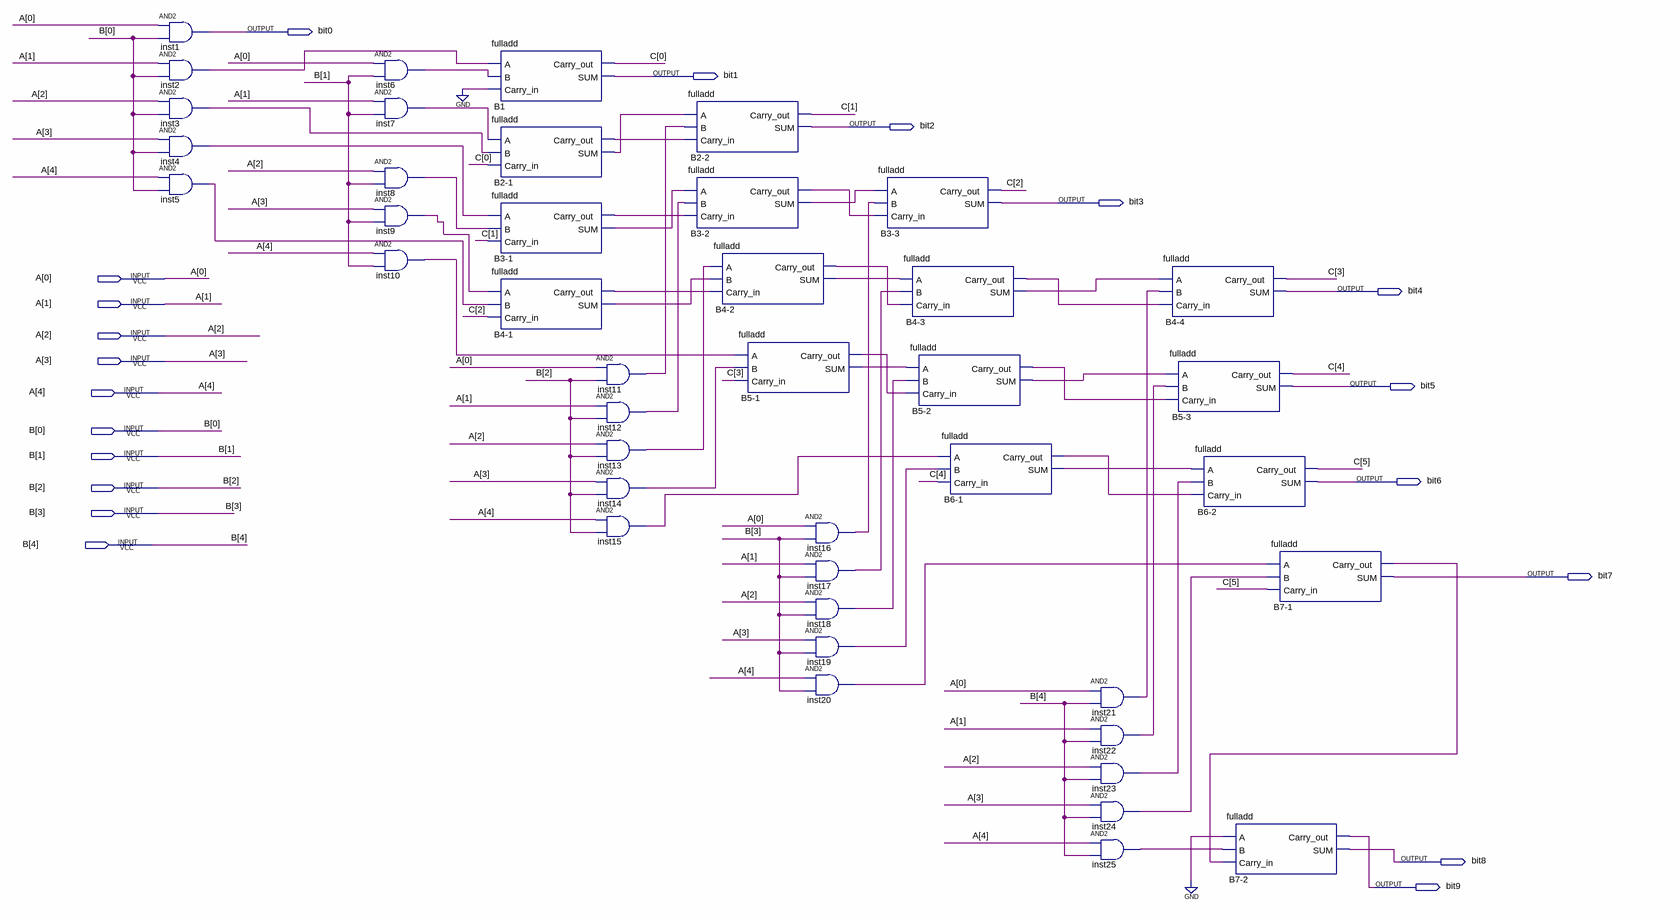
[diagram p0: schematic sheet]
// Quartus schematic multcomb2.bdf as structural Verilog: 42 symbols, 20 pins
module multcomb2 (
  input  [4:0] A,
  input  [4:0] B,
  output bit0,
  output bit1,
  output bit2,
  output bit3,
  output bit4,
  output bit5,
  output bit6,
  output bit7,
  output bit8,
  output bit9
);

  wire B2_1_carry_out, B2_1_sum, B3_1_carry_out, B3_1_sum, B3_2_carry_out, B3_2_sum, B4_1_carry_out,
       B4_1_sum, B4_2_carry_out, B4_2_sum, B4_3_carry_out, B4_3_sum, B5_1_carry_out, B5_1_sum,
       B5_2_carry_out, B5_2_sum, B6_1_carry_out, B6_1_sum, B7_1_carry_out, inst2_out, inst3_out, inst4_out,
       inst5_out, inst6_out, inst7_out, inst8_out, inst9_out, inst10_out, inst11_out, inst12_out, inst13_out,
       inst14_out, inst15_out, inst16_out, inst17_out, inst18_out, inst19_out, inst20_out, inst21_out,
       inst22_out, inst23_out, inst24_out, inst25_out;
  wire [5:0] C;

  and inst1 (bit0, A[0], B[0]);
  and inst2 (inst2_out, A[1], B[0]);
  and inst3 (inst3_out, A[2], B[0]);
  and inst4 (inst4_out, A[3], B[0]);
  and inst5 (inst5_out, A[4], B[0]);
  and inst6 (inst6_out, A[0], B[1]);
  and inst7 (inst7_out, A[1], B[1]);
  and inst8 (inst8_out, A[2], B[1]);
  and inst9 (inst9_out, A[3], B[1]);
  and inst10 (inst10_out, A[4], B[1]);
  fulladd B1 (.A(inst2_out), .B(inst6_out), .Carry_in(1'b0), .Carry_out(C[0]), .SUM(bit1));
  fulladd \B2-1  (.A(inst7_out), .B(inst3_out), .Carry_in(C[0]), .Carry_out(B2_1_carry_out), .SUM(B2_1_sum));
  fulladd \B3-1  (.A(inst4_out), .B(inst8_out), .Carry_in(C[1]), .Carry_out(B3_1_carry_out), .SUM(B3_1_sum));
  fulladd \B4-1  (.A(inst9_out), .B(inst5_out), .Carry_in(C[2]), .Carry_out(B4_1_carry_out), .SUM(B4_1_sum));
  and inst11 (inst11_out, A[0], B[2]);
  and inst12 (inst12_out, A[1], B[2]);
  and inst13 (inst13_out, A[2], B[2]);
  and inst14 (inst14_out, A[3], B[2]);
  and inst15 (inst15_out, A[4], B[2]);
  fulladd \B2-2  (.A(B2_1_sum), .B(inst11_out), .Carry_in(B2_1_carry_out), .Carry_out(C[1]), .SUM(bit2));
  fulladd \B3-2  (.A(B3_1_sum), .B(inst12_out), .Carry_in(B3_1_carry_out), .Carry_out(B3_2_carry_out), .SUM(B3_2_sum));
  fulladd \B4-2  (.A(inst13_out), .B(B4_1_sum), .Carry_in(B4_1_carry_out), .Carry_out(B4_2_carry_out), .SUM(B4_2_sum));
  fulladd \B5-1  (.A(inst10_out), .B(inst14_out), .Carry_in(C[3]), .Carry_out(B5_1_carry_out), .SUM(B5_1_sum));
  and inst16 (inst16_out, A[0], B[3]);
  and inst17 (inst17_out, A[1], B[3]);
  and inst18 (inst18_out, A[2], B[3]);
  and inst19 (inst19_out, A[3], B[3]);
  and inst20 (inst20_out, A[4], B[3]);
  fulladd \B3-3  (.A(B3_2_sum), .B(inst16_out), .Carry_in(B3_2_carry_out), .Carry_out(C[2]), .SUM(bit3));
  fulladd \B4-3  (.A(B4_2_sum), .B(inst17_out), .Carry_in(B4_2_carry_out), .Carry_out(B4_3_carry_out), .SUM(B4_3_sum));
  fulladd \B5-2  (.A(B5_1_sum), .B(inst18_out), .Carry_in(B5_1_carry_out), .Carry_out(B5_2_carry_out), .SUM(B5_2_sum));
  fulladd \B6-1  (.A(inst15_out), .B(inst19_out), .Carry_in(C[4]), .Carry_out(B6_1_carry_out), .SUM(B6_1_sum));
  and inst21 (inst21_out, A[0], B[4]);
  and inst22 (inst22_out, A[1], B[4]);
  and inst23 (inst23_out, A[2], B[4]);
  and inst24 (inst24_out, A[3], B[4]);
  and inst25 (inst25_out, A[4], B[4]);
  fulladd \B4-4  (.A(B4_3_sum), .B(inst21_out), .Carry_in(B4_3_carry_out), .Carry_out(C[3]), .SUM(bit4));
  fulladd \B5-3  (.A(B5_2_sum), .B(inst22_out), .Carry_in(B5_2_carry_out), .Carry_out(C[4]), .SUM(bit5));
  fulladd \B6-2  (.A(B6_1_sum), .B(inst23_out), .Carry_in(B6_1_carry_out), .Carry_out(C[5]), .SUM(bit6));
  fulladd \B7-1  (.A(inst20_out), .B(inst24_out), .Carry_in(C[5]), .Carry_out(B7_1_carry_out), .SUM(bit7));
  fulladd \B7-2  (.A(1'b0), .B(inst25_out), .Carry_in(B7_1_carry_out), .Carry_out(bit9), .SUM(bit8));
endmodule
